# Altium schematic sheet 5-3 fpga bank 14-16.SchDoc
size A4; SheetNumber: 7; SheetTotal: 13
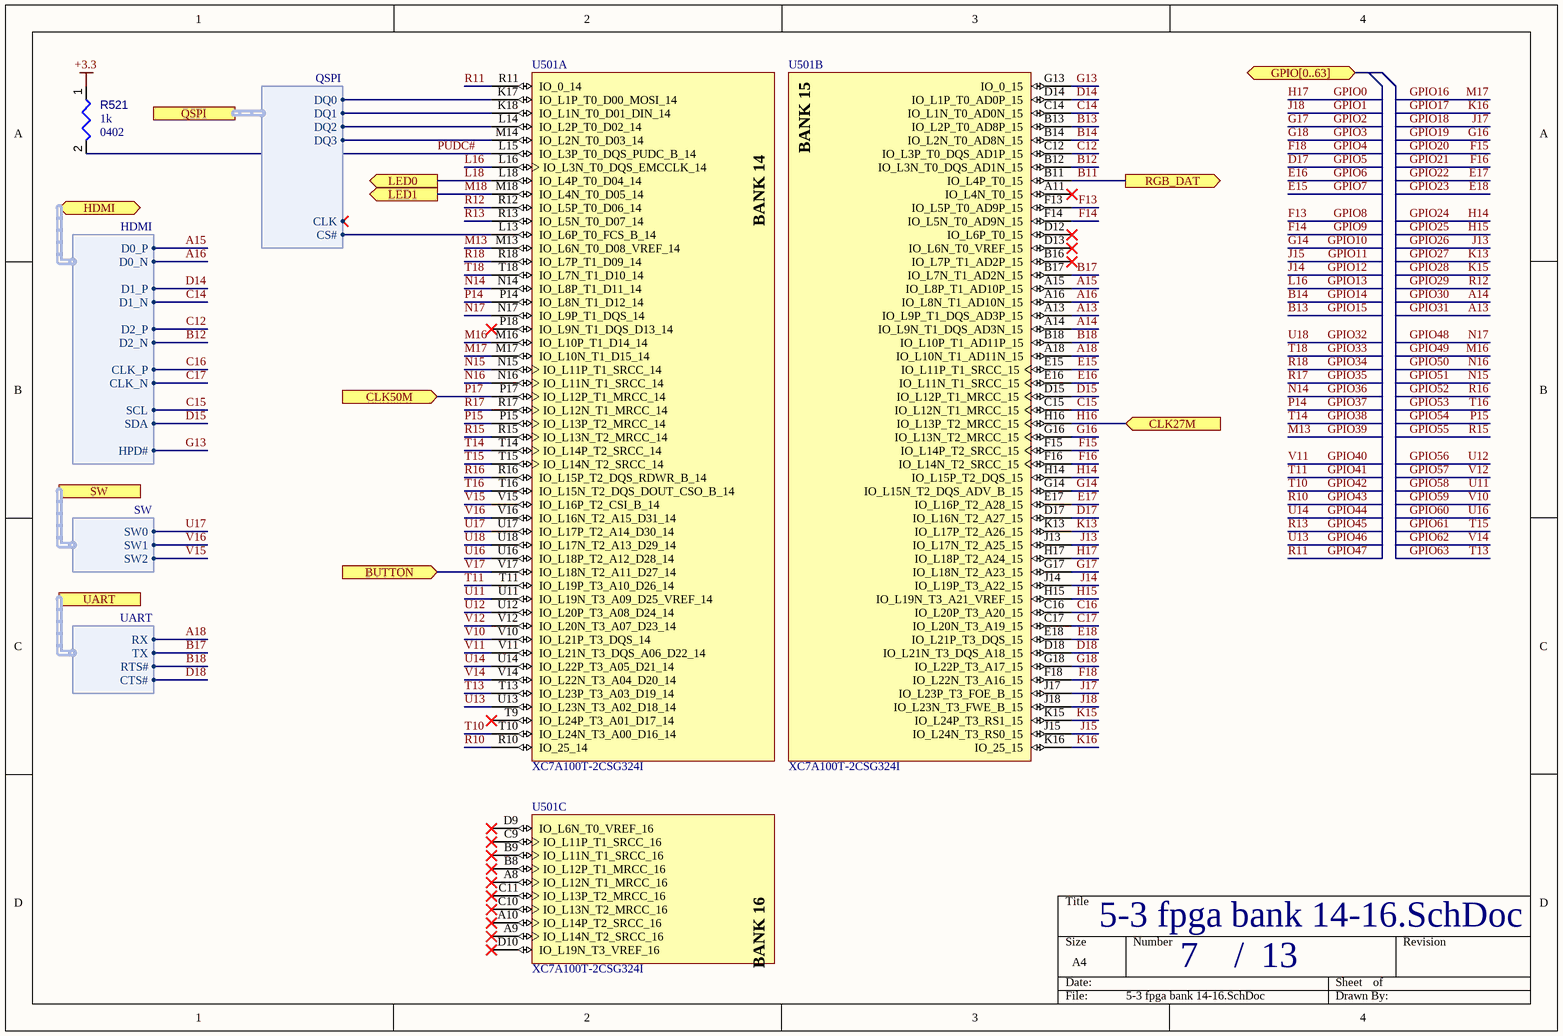
[diagram p0: 5-3 fpga bank 14-16.SchDoc]

## Parts
R521  value 1k  Case/Package: 0402  [RESC0402(1005)_L]  (hidden comment: Resistors,0402,1k)
U501  XC7A100T-2CSG324I  [CSG324]  (parts A,B,C of 9)

## Ports
BUTTON (in), CLK27M (in), CLK50M (in), GPIO[0..63] (bidir), HDMI (bidir, harness HDMI), LED0 (out), LED1 (out), QSPI (harness QSPI), RGB_DAT (out), SW (harness SW), UART (harness UART)

## Harnesses
QSPI: DQ0, DQ1, DQ2, DQ3, CS#, CLK
UART: TX, RX, RTS#, CTS#
SW: SW1, SW0, SW2
HDMI: D0_P, D0_N, D1_P, D1_N, D2_P, D2_N, CLK_P, CLK_N, SCL, SDA, HPD#

## Nets
+3.3: R521.1
A13: U501.A13(IO_L9P_T1_DQS_AD3P_15)  [also labelled GPIO31]
A14: U501.A14(IO_L9N_T1_DQS_AD3N_15)  [also labelled GPIO30]
A15: U501.A15(IO_L8P_T1_AD10P_15) ; port HDMI.D0_P
A16: U501.A16(IO_L8N_T1_AD10N_15) ; port HDMI.D0_N
A18: U501.A18(IO_L10N_T1_AD11N_15) ; port UART.RX
B11: U501.B11(IO_L4P_T0_15) ; port RGB_DAT
B12: U501.B12(IO_L3N_T0_DQS_AD1N_15) ; port HDMI.D2_N
B13: U501.B13(IO_L2P_T0_AD8P_15)  [also labelled GPIO15]
B14: U501.B14(IO_L2N_T0_AD8N_15)  [also labelled GPIO14]
B17: U501.B17(IO_L7N_T1_AD2N_15) ; port UART.TX
B18: U501.B18(IO_L10P_T1_AD11P_15) ; port UART.RTS#
C12: U501.C12(IO_L3P_T0_DQS_AD1P_15) ; port HDMI.D2_P
C14: U501.C14(IO_L1N_T0_AD0N_15) ; port HDMI.D1_N
C15: U501.C15(IO_L12N_T1_MRCC_15) ; port HDMI.SCL
C16: U501.C16(IO_L20P_T3_A20_15) ; port HDMI.CLK_P
C17: U501.C17(IO_L20N_T3_A19_15) ; port HDMI.CLK_N
D14: U501.D14(IO_L1P_T0_AD0P_15) ; port HDMI.D1_P
D15: U501.D15(IO_L12P_T1_MRCC_15) ; port HDMI.SDA
D17: U501.D17(IO_L16N_T2_A27_15)  [also labelled GPIO5]
D18: U501.D18(IO_L21N_T3_DQS_A18_15) ; port UART.CTS#
E15: U501.E15(IO_L11P_T1_SRCC_15)  [also labelled GPIO7]
E16: U501.E16(IO_L11N_T1_SRCC_15)  [also labelled GPIO6]
E17: U501.E17(IO_L16P_T2_A28_15)  [also labelled GPIO22]
E18: U501.E18(IO_L21P_T3_DQS_15)  [also labelled GPIO23]
F13: U501.F13(IO_L5P_T0_AD9P_15)  [also labelled GPIO8]
F14: U501.F14(IO_L5N_T0_AD9N_15)  [also labelled GPIO9]
F15: U501.F15(IO_L14P_T2_SRCC_15)  [also labelled GPIO20]
F16: U501.F16(IO_L14N_T2_SRCC_15)  [also labelled GPIO21]
F18: U501.F18(IO_L22N_T3_A16_15)  [also labelled GPIO4]
G13: U501.G13(IO_0_15) ; port HDMI.HPD#
G14: U501.G14(IO_L15N_T2_DQS_ADV_B_15)  [also labelled GPIO10]
G16: U501.G16(IO_L13N_T2_MRCC_15)  [also labelled GPIO19]
G17: U501.G17(IO_L18N_T2_A23_15)  [also labelled GPIO2]
G18: U501.G18(IO_L22P_T3_A17_15)  [also labelled GPIO3]
GPIO0: U501.H17(IO_L18P_T2_A24_15)  [also labelled H17]
GPIO1: U501.J18(IO_L23N_T3_FWE_B_15)  [also labelled J18]
GPIO11: U501.J15(IO_L24N_T3_RS0_15)  [also labelled J15]
GPIO12: U501.J14(IO_L19P_T3_A22_15)  [also labelled J14]
GPIO13: U501.L16(IO_L3N_T0_DQS_EMCCLK_14)  [also labelled L16]
GPIO16: U501.M17(IO_L10N_T1_D15_14)  [also labelled M17]
GPIO17: U501.K16(IO_25_15)  [also labelled K16]
GPIO18: U501.J17(IO_L23P_T3_FOE_B_15)  [also labelled J17]
GPIO24: U501.H14(IO_L15P_T2_DQS_15)  [also labelled H14]
GPIO25: U501.H15(IO_L19N_T3_A21_VREF_15)  [also labelled H15]
GPIO26: U501.J13(IO_L17N_T2_A25_15)  [also labelled J13]
GPIO27: U501.K13(IO_L17P_T2_A26_15)  [also labelled K13]
GPIO28: U501.K15(IO_L24P_T3_RS1_15)  [also labelled K15]
GPIO29: U501.R12(IO_L5P_T0_D06_14)  [also labelled R12]
GPIO32: U501.U18(IO_L17N_T2_A13_D29_14)  [also labelled U18]
GPIO33: U501.T18(IO_L7N_T1_D10_14)  [also labelled T18]
GPIO34: U501.R18(IO_L7P_T1_D09_14)  [also labelled R18]
GPIO35: U501.R17(IO_L12N_T1_MRCC_14)  [also labelled R17]
GPIO36: U501.N14(IO_L8P_T1_D11_14)  [also labelled N14]
GPIO37: U501.P14(IO_L8N_T1_D12_14)  [also labelled P14]
GPIO38: U501.T14(IO_L14P_T2_SRCC_14)  [also labelled T14]
GPIO39: U501.M13(IO_L6N_T0_D08_VREF_14)  [also labelled M13]
GPIO40: U501.V11(IO_L21N_T3_DQS_A06_D22_14)  [also labelled V11]
GPIO41: U501.T11(IO_L19P_T3_A10_D26_14)  [also labelled T11]
GPIO42: U501.T10(IO_L24N_T3_A00_D16_14)  [also labelled T10]
GPIO43: U501.R10(IO_25_14)  [also labelled R10]
GPIO44: U501.U14(IO_L22P_T3_A05_D21_14)  [also labelled U14]
GPIO45: U501.R13(IO_L5N_T0_D07_14)  [also labelled R13]
GPIO46: U501.U13(IO_L23N_T3_A02_D18_14)  [also labelled U13]
GPIO47: U501.R11(IO_0_14)  [also labelled R11]
GPIO48: U501.N17(IO_L9P_T1_DQS_14)  [also labelled N17]
GPIO49: U501.M16(IO_L10P_T1_D14_14)  [also labelled M16]
GPIO50: U501.N16(IO_L11N_T1_SRCC_14)  [also labelled N16]
GPIO51: U501.N15(IO_L11P_T1_SRCC_14)  [also labelled N15]
GPIO52: U501.R16(IO_L15P_T2_DQS_RDWR_B_14)  [also labelled R16]
GPIO53: U501.T16(IO_L15N_T2_DQS_DOUT_CSO_B_14)  [also labelled T16]
GPIO54: U501.P15(IO_L13P_T2_MRCC_14)  [also labelled P15]
GPIO55: U501.R15(IO_L13N_T2_MRCC_14)  [also labelled R15]
GPIO56: U501.U12(IO_L20P_T3_A08_D24_14)  [also labelled U12]
GPIO57: U501.V12(IO_L20N_T3_A07_D23_14)  [also labelled V12]
GPIO58: U501.U11(IO_L19N_T3_A09_D25_VREF_14)  [also labelled U11]
GPIO59: U501.V10(IO_L21P_T3_DQS_14)  [also labelled V10]
GPIO60: U501.U16(IO_L18P_T2_A12_D28_14)  [also labelled U16]
GPIO61: U501.T15(IO_L14N_T2_SRCC_14)  [also labelled T15]
GPIO62: U501.V14(IO_L22N_T3_A04_D20_14)  [also labelled V14]
GPIO63: U501.T13(IO_L23P_T3_A03_D19_14)  [also labelled T13]
H16: U501.H16(IO_L13P_T2_MRCC_15) ; port CLK27M
L18: U501.L18(IO_L4P_T0_D04_14) ; port LED0
M18: U501.M18(IO_L4N_T0_D05_14) ; port LED1
P17: U501.P17(IO_L12P_T1_MRCC_14) ; port CLK50M
PUDC#: R521.2 U501.L15(IO_L3P_T0_DQS_PUDC_B_14)
U17: U501.U17(IO_L17P_T2_A14_D30_14) ; port SW.SW0
V15: U501.V15(IO_L16P_T2_CSI_B_14) ; port SW.SW2
V16: U501.V16(IO_L16N_T2_A15_D31_14) ; port SW.SW1
V17: U501.V17(IO_L18N_T2_A11_D27_14) ; port BUTTON
NetU501_K17: U501.K17(IO_L1P_T0_D00_MOSI_14) ; port QSPI.DQ0
NetU501_K18: U501.K18(IO_L1N_T0_D01_DIN_14) ; port QSPI.DQ1
NetU501_L13: U501.L13(IO_L6P_T0_FCS_B_14) ; port QSPI.CS#
NetU501_L14: U501.L14(IO_L2P_T0_D02_14) ; port QSPI.DQ2
NetU501_M14: U501.M14(IO_L2N_T0_D03_14) ; port QSPI.DQ3

Not connected (* = marked no-connect by the designer): U501 A8(IO_L12N_T1_MRCC_16)* A9(IO_L14N_T2_SRCC_16)* A10(IO_L14P_T2_SRCC_16)* A11(IO_L4N_T0_15)* B8(IO_L12P_T1_MRCC_16)* B9(IO_L11N_T1_SRCC_16)* B16(IO_L7P_T1_AD2P_15)* C9(IO_L11P_T1_SRCC_16)* C10(IO_L13N_T2_MRCC_16)* C11(IO_L13P_T2_MRCC_16)* D9(IO_L6N_T0_VREF_16)* D10(IO_L19N_T3_VREF_16)* D12(IO_L6P_T0_15)* D13(IO_L6N_T0_VREF_15)* P18(IO_L9N_T1_DQS_D13_14)* T9(IO_L24P_T3_A01_D17_14)*

## Notes on the sheet
- /
- (in symbol CMP-0364-00002-3, part A) BANK 14
- (in symbol CMP-0364-00002-3, part B) BANK 15
- (in symbol CMP-0364-00002-3, part C) BANK 16

## Library data of the parts
R521 = Resistors: Resistor; Component Type: Resistors
U501 = CMP-0364-00002-3: Artix-7 FPGA, 210 User I/Os, 0 GTP, 324-Ball BGA, Speed Grade 2, Extended Grade, Pb-Free; Manufacturer: Xilinx; Block RAM Blocks (36Kb): 135; Logic Cells: 101440; Clock Mgmt Tiles (CMTs): 6; Block RAM Blocks (18Kb): 270; CLBs (Slices): 15850; Block RAM Blocks (Max Kb): 4860; Max User I/O: 300; Speed Grade: -2; DSP48E1 Slices: 240; ComponentLink5URL: http://www.xilinx.com/support/documentation/user_guides/ug475_7Series_Pkg_Pinout.pdf; ComponentLink4Description: Package File; PackageDescription: Wire-Bond Chip-Scale BGA, Body 15 x 15 mm, 0.8 mm Pitch; RoHS: Pb-Free; ComponentLink5Description: Packaging and Pinout; ComponentLink2URL: http://www.xilinx.com/support/documentation/user_guides/ug475_7Series_Pkg_Pinout.pdf; ComponentLink2Description: Package Specification; PartNumber: XC7A100T-2CSG324I; Mounting Technology: Surface Mount; ComponentLink3Description: DC and Switching Characteristics; PackageVersion: Rev 1.8; Code_JEDEC: MO-275-KKAC-1; PackageReference: CSG324; NexusDeviceID: XC7A100T-2CSG324I; ComponentLink4URL: http://www.xilinx.com/support/packagefiles/a7packages/xc7a100tcsg324pkg.txt; ComponentLink3URL: http://www.xilinx.com/support/documentation/data_sheets/ds181_Artix_7_Data_Sheet.pdf; ComponentLink1Description: Datasheet; DatasheetVersion: v1.12; ComponentLink1URL: http://www.xilinx.com/support/documentation/data_sheets/ds180_7Series_Overview.pdf; Generic Part Number: XC7A100T; CLBs (Max Distributed RAM Kb): 1188